# Altium schematic sheet S01_Cover.SchDoc
size A4
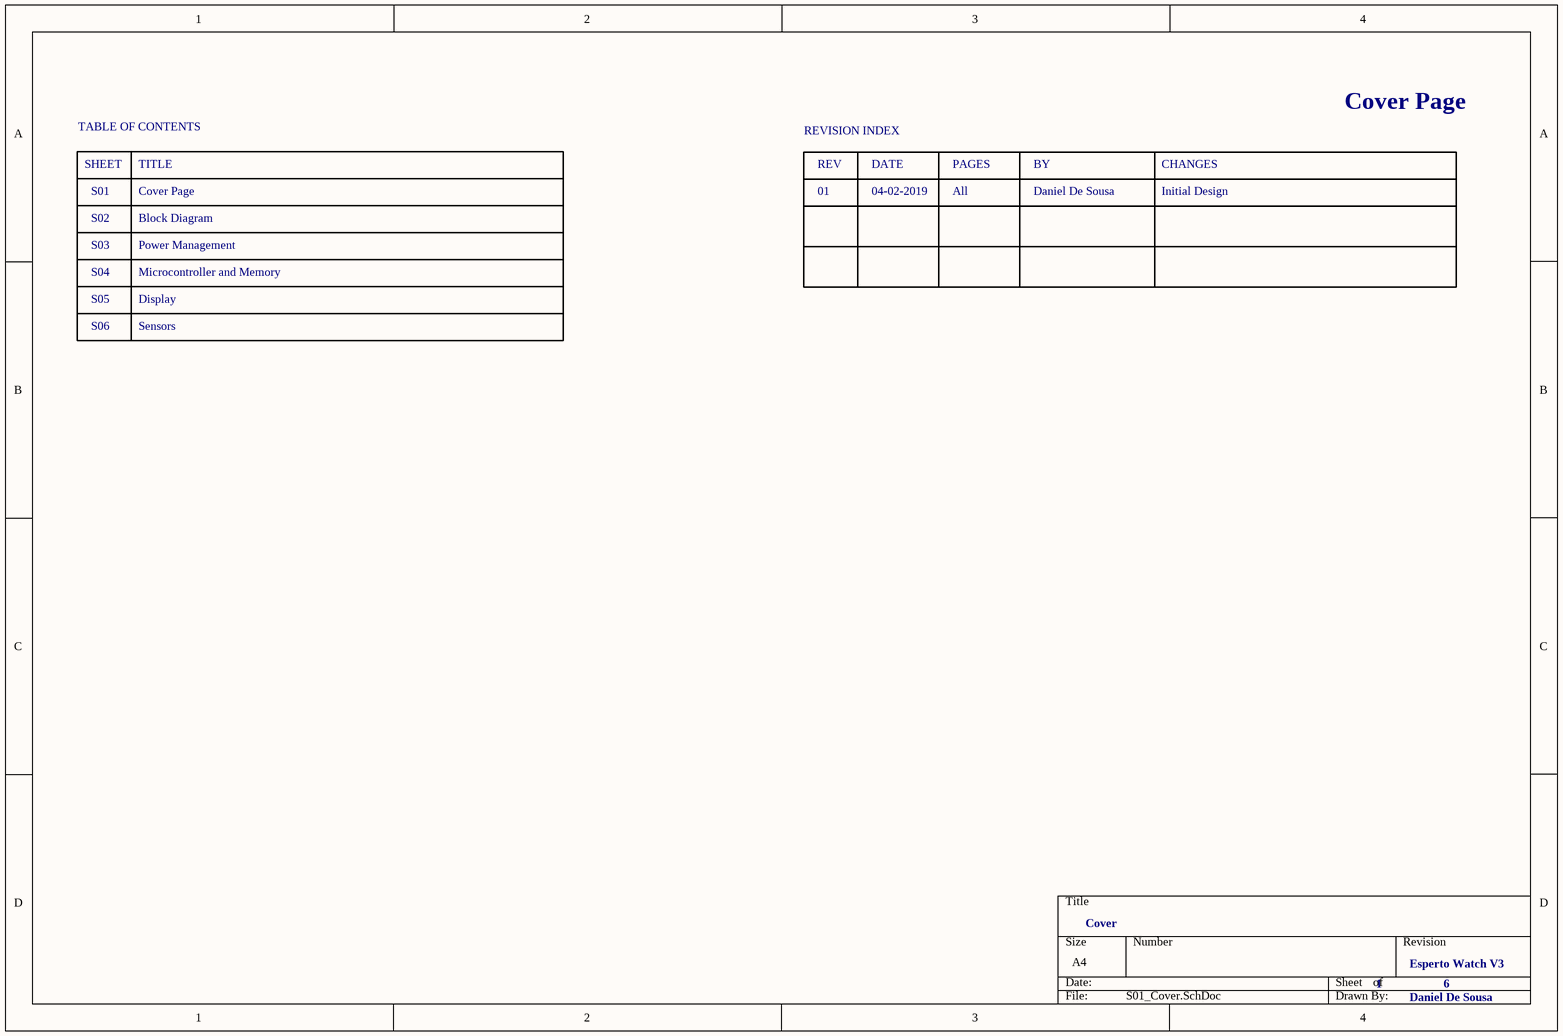
[diagram p0: S01_Cover.SchDoc]

## Notes on the sheet
- Cover Page
- TABLE OF CONTENTS
- SHEET
- TITLE
- REVISION INDEX
- REV
- DATE
- PAGES
- BY
- CHANGES
- S01
- S02
- S03
- Block Diagram
- Power Management
- 01
- 04-02-2019
- All
- Daniel De Sousa
- Initial Design
- S04
- S05
- Display
- Microcontroller and Memory
- S06
- Sensors
- Cover
- 1
- Esperto Watch V3
- 6